# EAGLE design testing_board (EAGLE 8.6.0)
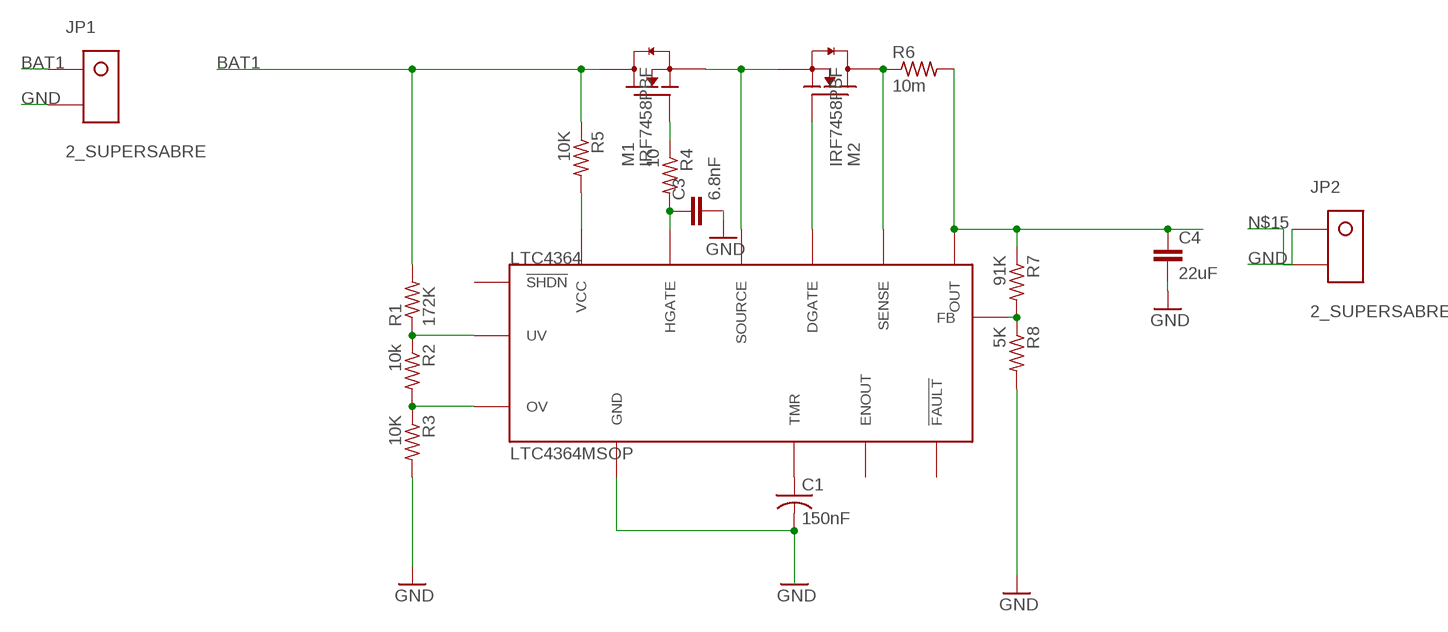
[diagram p0: schematic, sheet 1]

## Parts
C1  150nF  C-USC0805  [C0805]
C3  6.8nF  C-EUC0805  [C0805]
C4  22uF  C-EUC0805  [C0805]
JP1  2_SUPERSABRE  [SUPERSABRE_2CIRCUIT]
JP2  2_SUPERSABRE  [SUPERSABRE_2CIRCUIT]
LTC4364  LTC4364MSOP  [MSOP16]
M1  IRF7458PBF  [SOIC8]
M2  IRF7458PBF  [SOIC8]
R1  172K  R-US_R0805  [R0805]
R2  10k  R-US_R0805  [R0805]
R3  10K  R-US_R0805  [R0805]
R4  10  R-US_R0805  [R0805]
R5  10K  R-US_R0805  [R0805]
R6  10m  CSSH0.01OHM  [2827W]
R7  91K  R-US_R0805  [R0805]
R8  5K  R-US_R0805  [R0805]

## Nets
BAT1: JP1.P$1 M1.D1(D) M1.D2(D) M1.D3(D) M1.D4(D) R1.2 R5.1
GND: C1.2 C3.2 C4.2 JP1.P$2 JP2.P$1 LTC4364.GND R3.2 R8.2
N$1: LTC4364.DGATE M2.G1(G)
N$2: LTC4364.SOURCE M1.S1(S) M1.S2(S) M1.S3(S) M2.S1(S) M2.S2(S) M2.S3(S)
N$3: C1.1 LTC4364.TMR
N$4: LTC4364.UV R1.1 R2.1
N$5: LTC4364.OV R2.2 R3.1
N$6: M1.G1(G) R4.1
N$7: LTC4364.FB R7.2 R8.1
N$8: C3.1 LTC4364.HGATE R4.2
N$11: LTC4364.SENSE M2.D1(D) M2.D2(D) M2.D3(D) M2.D4(D) R6.P$1
N$13: LTC4364.VCC R5.2
N$15: C4.1 JP2.P$2 LTC4364.OUT R6.P$2 R7.1
Unconnected: LTC4364.ENOUT LTC4364.FLT(!FAULT!) LTC4364.SHDN(!SHDN!)

## Library data of the parts
C1 = resistor:C-US: CAPACITOR, American symbol; SPICEPREFIX: C
C3 C4 = resistor:C-EU: CAPACITOR, European symbol
JP1 JP2 = molex:2_SUPERSABRE: Molex SuperSabre 2-pin vertical header
LTC4364 = linear:LTC4364; SPICEPREFIX: X
M1 M2 = transistor-fet:IRF7458PBF: N-Channel Enhancement Type MOSFET; SPICEPREFIX: M
R1-R5 R7 R8 = resistor:R-US_: RESISTOR, American symbol
R6 = resistor:CSSH0.01OHM

## Board
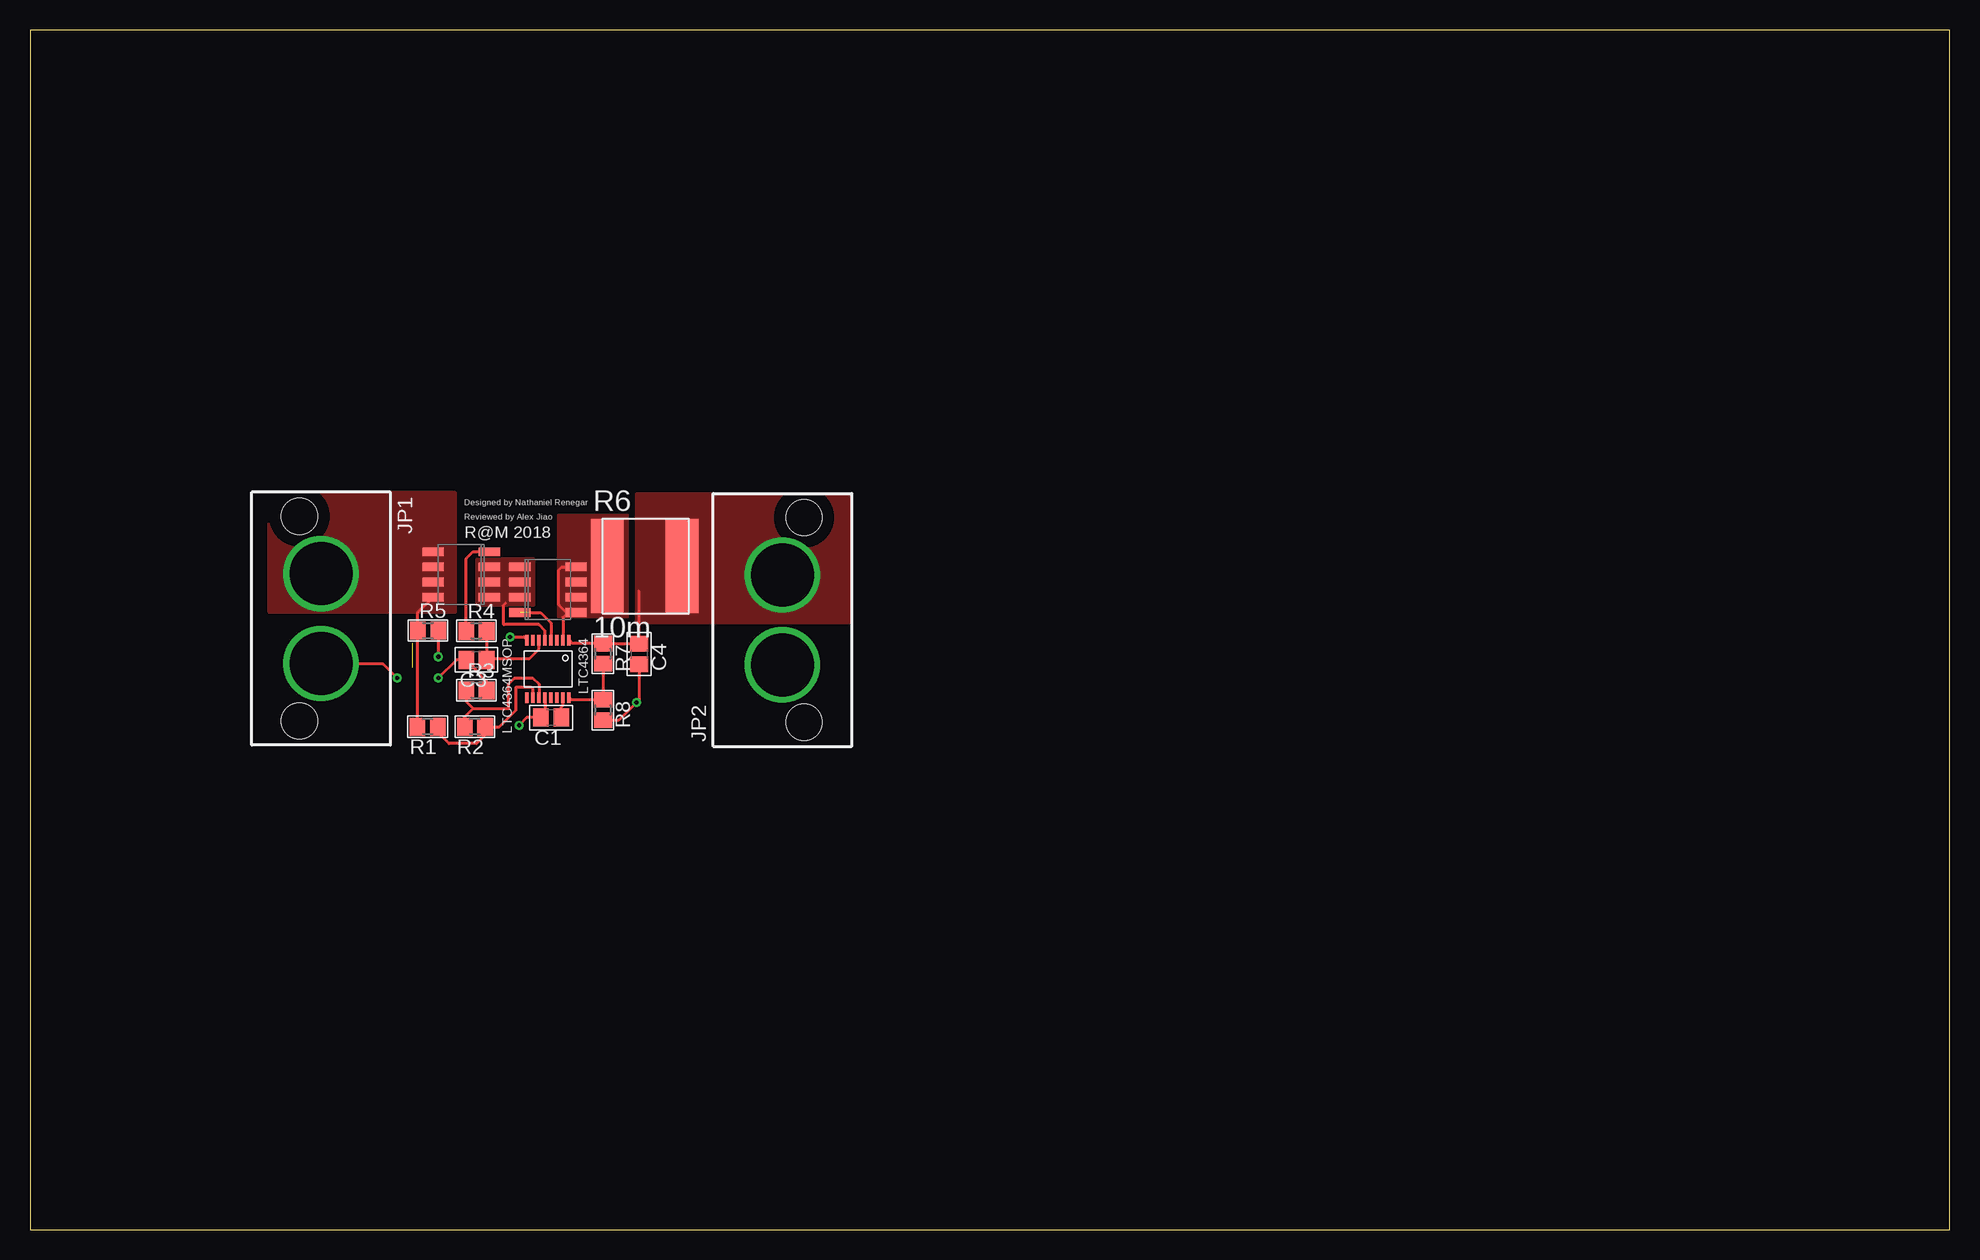
[diagram p1: board, top side]
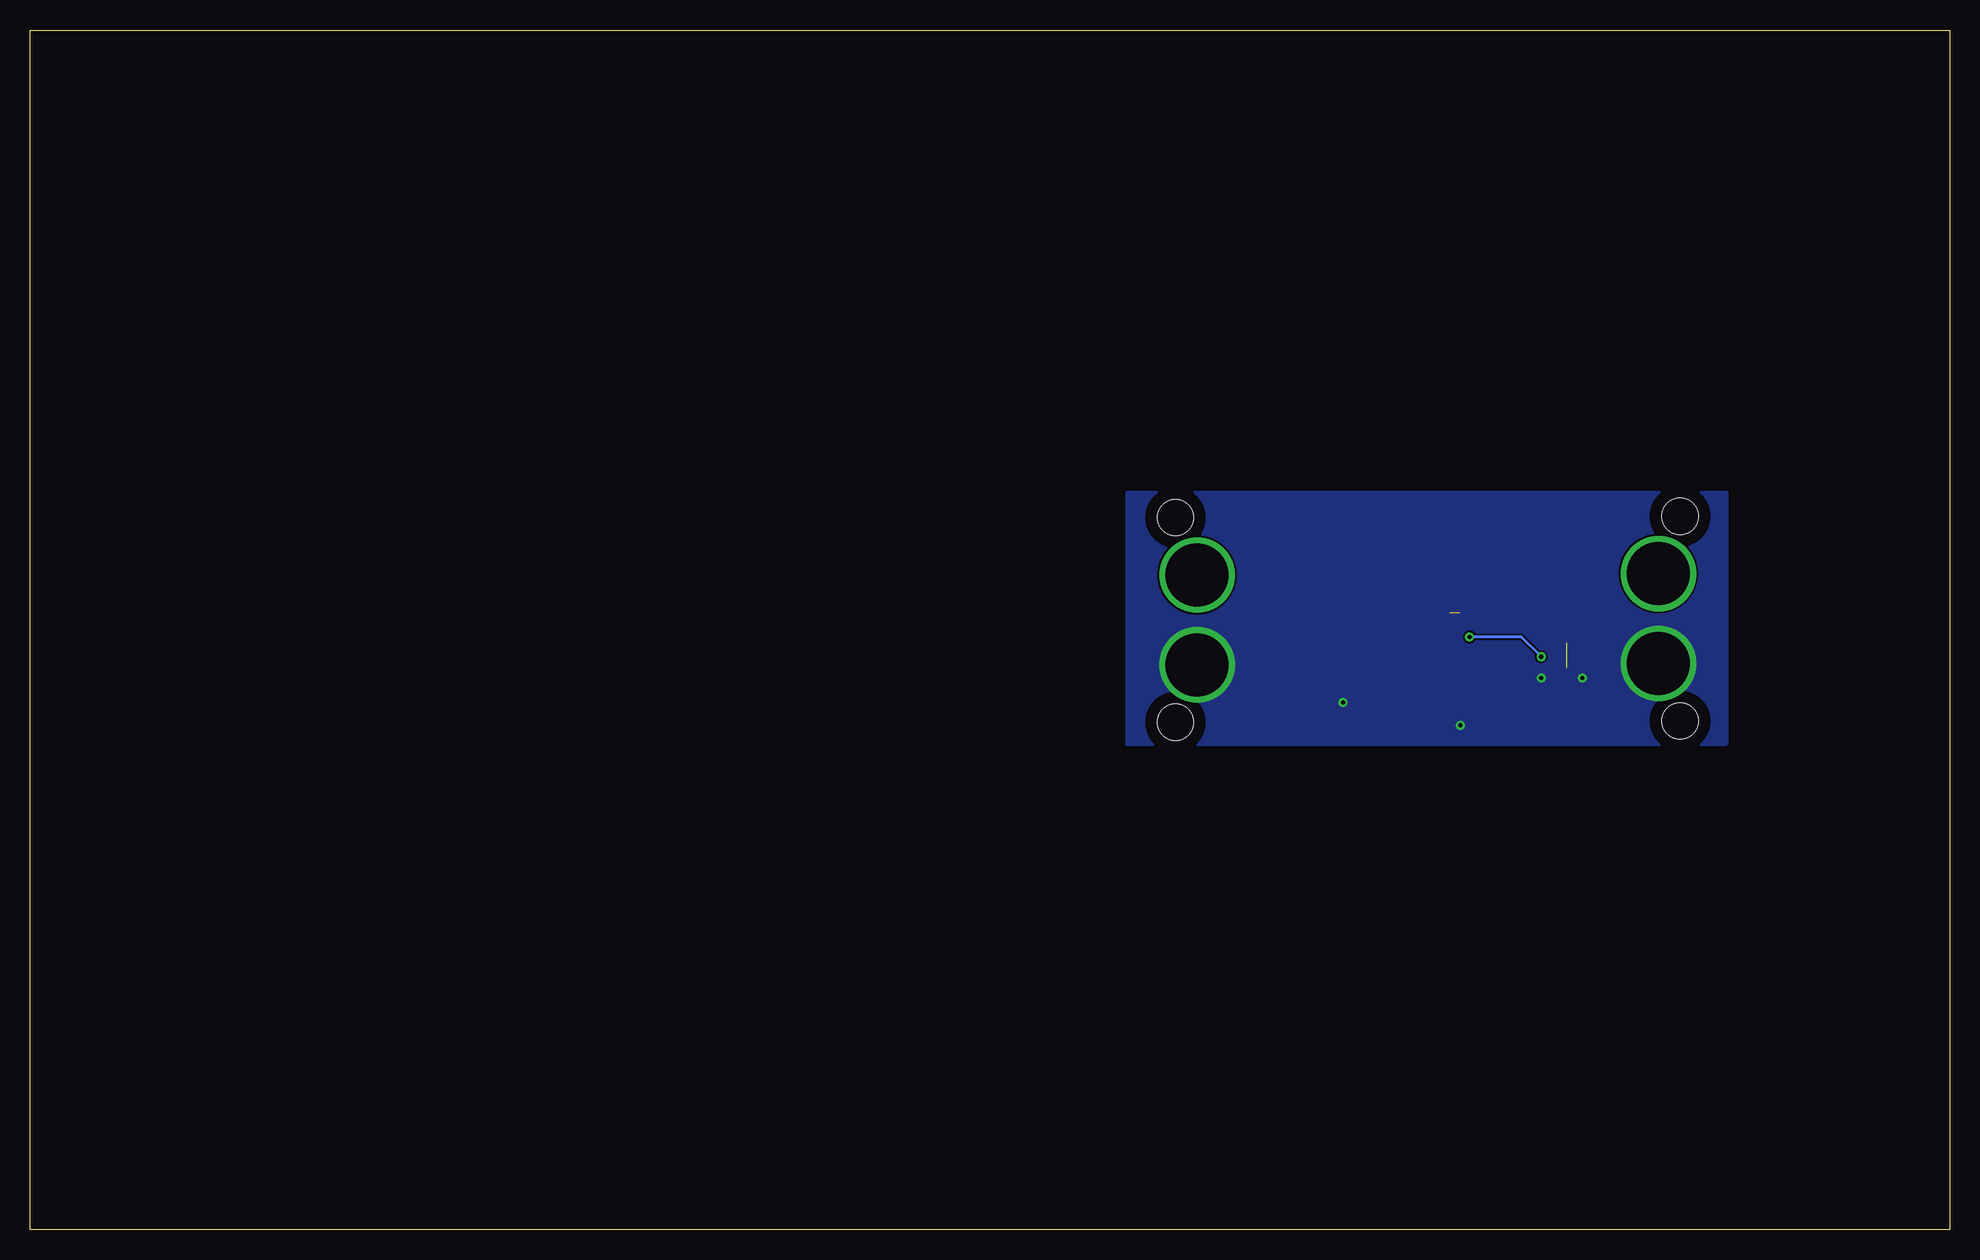
[diagram p2: board, bottom side, seen from below]

Size 160 x 100 mm. Coordinates in mm from the lower left corner, seen from the top.
Outline: 0,0 160,0 160,100 0,100 0,0
Copper layers (1*16): Top 0.035mm / dielectric 1.5mm / Bottom 0.035mm
Design rules "default": minimum track width 6mil, minimum drill 0.35mm, track to track 6mil, track to pad 6mil, pad to pad 6mil, via to via 6mil, smd to smd 6mil, copper to edge 40mil, drill to drill 6mil, minimum pad ring 10mil, minimum via ring 8mil, stop-mask expansion 4mil, vias tented up to drill 0mil, thermal gap 10mil

### Footprints (pad centres in the part's own frame; a part is rotated, then mirrored left to right if it is on the bottom)
C0805 = smd 1.3 x 1.5: 1 -0.85,0; 2 0.85,0
SUPERSABRE_2CIRCUIT = drill 5.25: P$1 -3.747,0; P$2 3.747,0 | hole 2.997: -8.534,-1.803; 8.534,-1.803
MSOP16 = smd 0.305 x 0.889: DGATE -0.25,-2.39; ENOUT -0.75,2.39; FB -1.75,2.39; FLT -0.25,2.39; GND 0.25,2.39; HGATE 0.75,-2.39; NC -0.75,-2.39; NC1 1.25,-2.39; OUT -1.75,-2.39; OV 0.75,2.39; SENSE -1.25,-2.39; SHDN 1.75,2.39; SOURCE 0.25,-2.39; TMR -1.25,2.39; UV 1.25,2.39; VCC 1.75,-2.39
SOIC8 = smd 0.72 x 1.78: D1 1.905,2.34; D2 0.635,2.34; D3 -0.635,2.34; D4 -1.905,2.34; G1 1.905,-2.34; S1 -1.905,-2.34; S2 -0.635,-2.34; S3 0.635,-2.34
R0805 = smd 1.3 x 1.5: 1 -0.85,0; 2 0.85,0
2827W = smd 2.743 x 7.823: P$1 -3.124,0; P$2 3.124,0

### Placement (x,y rotation side)
C1  43.43,42.67 180 top
C3  37.21,47.5 180 top
C4  50.77,47.97 270 top
JP1  24.26,50.93 270 top
JP2  62.72,50.82 90 top
LTC4364  43.18,46.74 180 top
M1  35.94,54.61 90 top
M2  43.18,53.34 270 top
R1  33.15,41.91 180 top
R2  37.08,41.91 180 top
R3  37.21,44.96 0 top
R4  37.21,49.91 0 top
R5  33.18,49.94 0 top
R6  51.25,55.31 0 top
R7  47.75,48.01 270 top
R8  47.75,43.31 270 top

### Tracks (layer width: path | path; a pad name or v marks a point on that pad's centre or on a via)
BAT1
  Top 0.254: R1.2 32.3,49.91 R5.1 32.33,51.43 M1.D4
  pour Top (no thermals): 35.43,61.47 35.43,51.44 19.94,51.44 19.94,61.34 19.94,61.47
GND  (via drill 0.35)
  Top 0.254: R8.2 49.06,42.46 v50.55,43.94 50.77,44.16 C4.2 | LTC4364.GND 42.93,43.02 C1.2 41.4,42.67 v40.77,42.04 | R3.2 38.06,45.7 37.13,46.63 37.13,46.73 C3.2 35.56,47.5 v34.04,45.97 | JP1.P$2 29.4,47.18 v30.61,45.97
  pour Bottom (rank 4, no thermals): 18.54,61.47 18.54,40.51 18.67,40.39 68.58,40.39 68.58,61.21 68.58,61.34 68.58,61.47
N$1  (1 unrouted)
  Top 0.254: 41.66,51.44 42.55,51.44 43.43,50.55 LTC4364.DGATE
N$2
  Top 0.254: LTC4364.SOURCE 42.93,49.91 42.42,50.42 39.5,50.42 39.5,52.07 39.62,52.2
  pour Top (rank 2, no thermals): 37.21,52.07 42.04,52.07 42.04,55.88 37.21,55.88
N$3
  Top 0.254: C1.1 44.28,43.52 44.45,43.69 44.43,43.71 LTC4364.TMR
N$4
  Top 0.254: LTC4364.UV 41.91,44.37 41.91,45.09 41.78,45.21 40.51,45.21 40.51,43.31 39.12,41.91 R2.1 37.93,41.24 37.21,40.51 34.92,40.51 34,41.44 R1.1
N$5
  Top 0.254: R2.2 36.23,42.71 36.96,43.43 | 36.96,43.43 39.88,43.43 39.88,45.47 40.39,45.97 41.91,45.97 42.42,45.47 42.42,44.36 LTC4364.OV | R3.1 36.36,44.03 36.96,43.43
N$6
  Top 0.254: R4.1 36.36,55.92 36.96,56.52 M1.G1
N$7
  Top 0.254: LTC4364.FB 45.12,44.16 R8.1 R7.2
N$8
  Top 0.254: R4.2 C3.1 38.19,47.62 41.66,47.62 42.43,48.4 LTC4364.HGATE
N$9  (1 unrouted)
N$11
  Top 0.254: 44.83,51.56 44.58,51.56 44.07,52.07 44.07,54.99 44.32,55.24 44.7,55.24 | M2.D1 44.83,51.44 44.43,51.03 LTC4364.SENSE
  pour Top (no thermals): 44.07,59.56 49.78,59.56 49.78,51.05 44.07,51.05
N$13  (via drill 0.35)
  Top 0.254: R5.2 v34.03,47.76 v34.04,47.75 | v40.01,49.4 41.15,49.4 LTC4364.VCC
  Bottom 0.254: v34.04,47.75 35.69,49.4 v40.01,49.4
N$15
  Top 0.254: LTC4364.OUT 45.2,48.86 R7.1 47.78,48.82 C4.1 50.77,53.22
  pour Top (rank 2, no thermals): 50.55,50.55 50.55,61.34 68.45,61.34 68.45,50.55

### Text on the board
_tsilk: Designed by Nathaniel Renegar | Reviewed by Alex Jiao | R@M 2018